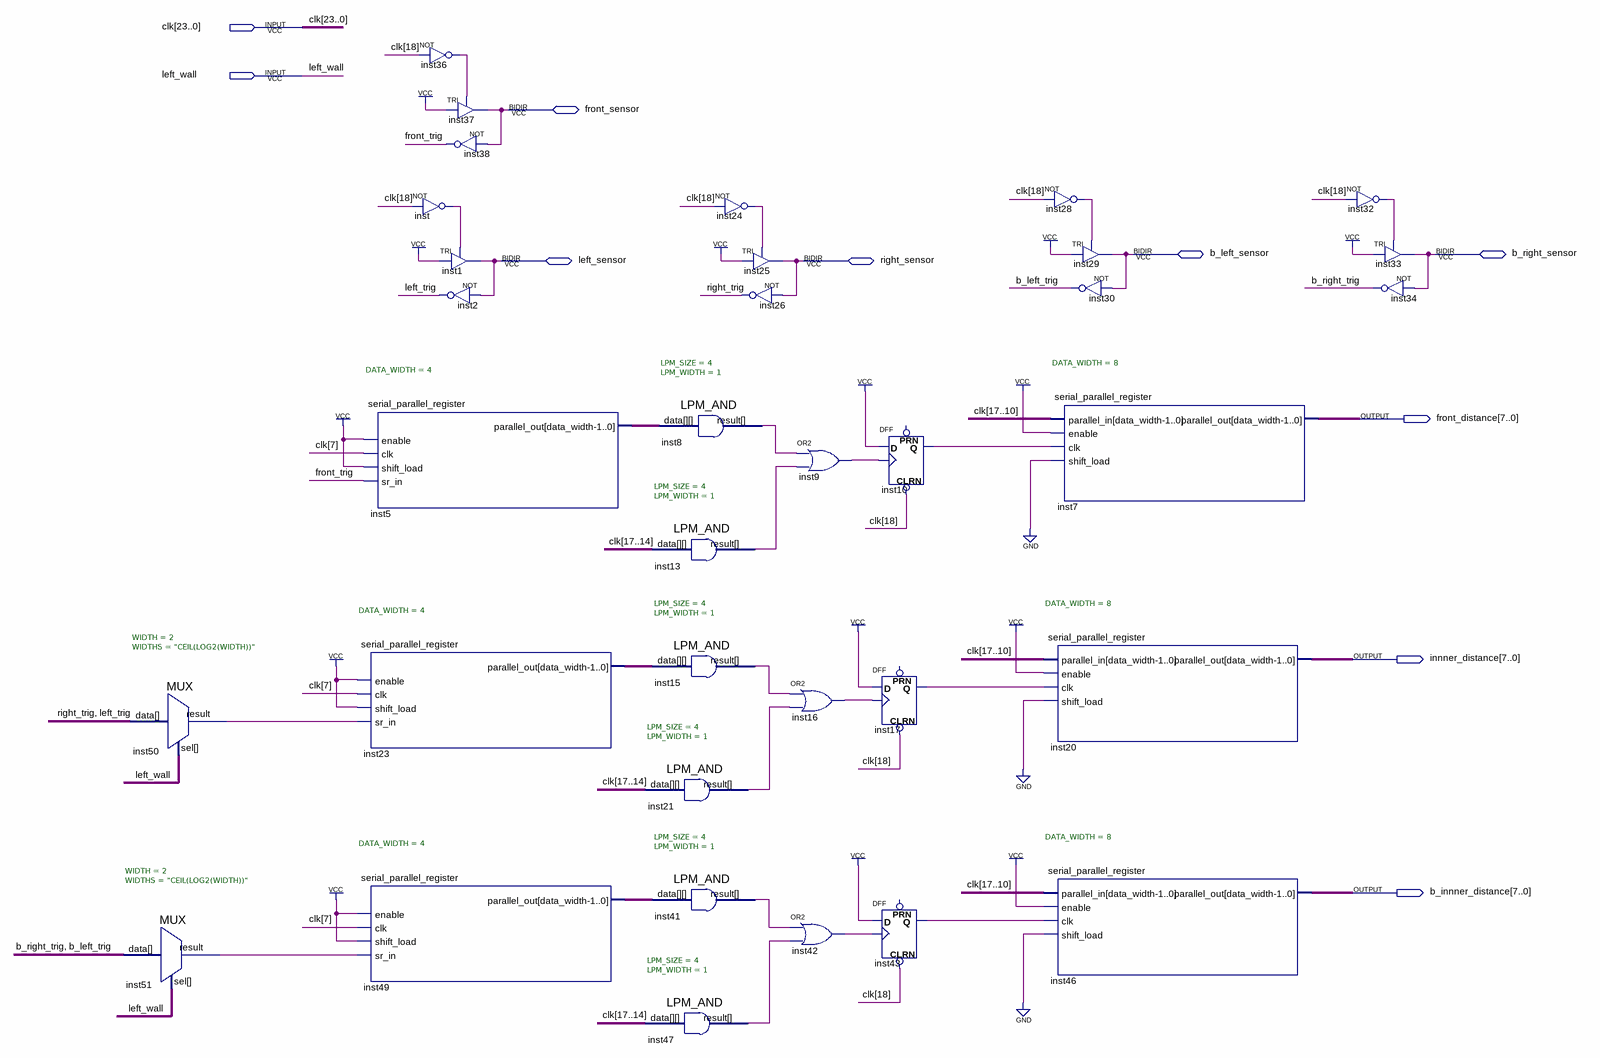
[diagram p0: schematic sheet]
// Quartus schematic IR_sensor_group.bdf as structural Verilog: 35 symbols, 10 pins
module IR_sensor_group (
  input  [23:0] clk,
  input  left_wall,
  inout  front_sensor,
  inout  b_left_sensor,
  inout  b_right_sensor,
  inout  left_sensor,
  inout  right_sensor,
  output [7:0] front_distance,
  output [7:0] innner_distance,
  output [7:0] b_innner_distance
);

  wire b_left_trig, b_right_trig, front_trig, inst8_result, inst9_out, inst10_q, inst13_result,
       inst15_result, inst16_out, inst17_q, inst21_result, inst24_out, inst28_out, inst32_out, inst36_out,
       inst41_result, inst42_out, inst43_q, inst47_result, inst50_result, inst51_result, inst_out, left_trig,
       right_trig;
  wire [3:0] inst5_parallel_out, inst23_parallel_out, inst49_parallel_out;

  MUX #(.WIDTH(2), .WIDTHS("CEIL(LOG2(WIDTH))")) inst50 (
    .data({right_trig, left_trig}), .sel(left_wall), .result(inst50_result));
  MUX #(.WIDTH(2), .WIDTHS("CEIL(LOG2(WIDTH))")) inst51 (
    .data({b_right_trig, b_left_trig}), .sel(left_wall), .result(inst51_result));
  serial_parallel_register #(.DATA_WIDTH(4)) inst5 (
    .clk(clk[7]), .enable(1'b1), .shift_load(1'b1), .sr_in(front_trig), .parallel_out(inst5_parallel_out));
  serial_parallel_register #(.DATA_WIDTH(4)) inst23 (
    .clk(clk[7]), .enable(1'b1), .shift_load(1'b1), .sr_in(inst50_result), .parallel_out(inst23_parallel_out));
  serial_parallel_register #(.DATA_WIDTH(4)) inst49 (
    .clk(clk[7]), .enable(1'b1), .shift_load(1'b1), .sr_in(inst51_result), .parallel_out(inst49_parallel_out));
  not inst36 (inst36_out, clk[18]);
  TRI inst37 (.IN(1'b1), .OE(inst36_out), .OUT(front_sensor));
  not inst38 (front_trig, front_sensor);
  not inst (inst_out, clk[18]);
  TRI inst1 (.IN(1'b1), .OE(inst_out), .OUT(left_sensor));
  not inst2 (left_trig, left_sensor);
  LPM_AND #(.LPM_SIZE(4), .LPM_WIDTH(1)) inst8 (.data(inst5_parallel_out), .result(inst8_result));
  LPM_AND #(.LPM_SIZE(4), .LPM_WIDTH(1)) inst13 (.data(clk[17:14]), .result(inst13_result));
  LPM_AND #(.LPM_SIZE(4), .LPM_WIDTH(1)) inst15 (.data(inst23_parallel_out), .result(inst15_result));
  LPM_AND #(.LPM_SIZE(4), .LPM_WIDTH(1)) inst21 (.data(clk[17:14]), .result(inst21_result));
  LPM_AND #(.LPM_SIZE(4), .LPM_WIDTH(1)) inst41 (.data(inst49_parallel_out), .result(inst41_result));
  LPM_AND #(.LPM_SIZE(4), .LPM_WIDTH(1)) inst47 (.data(clk[17:14]), .result(inst47_result));
  not inst24 (inst24_out, clk[18]);
  TRI inst25 (.IN(1'b1), .OE(inst24_out), .OUT(right_sensor));
  not inst26 (right_trig, right_sensor);
  or inst9 (inst9_out, inst8_result, inst13_result);
  or inst16 (inst16_out, inst15_result, inst21_result);
  or inst42 (inst42_out, inst41_result, inst47_result);
  DFF inst10 (.CLRN(clk[18]), .CLK(inst9_out), .D(1'b1), .Q(inst10_q));  // open: PRN
  DFF inst17 (.CLRN(clk[18]), .CLK(inst16_out), .D(1'b1), .Q(inst17_q));  // open: PRN
  DFF inst43 (.CLRN(clk[18]), .CLK(inst42_out), .D(1'b1), .Q(inst43_q));  // open: PRN
  not inst28 (inst28_out, clk[18]);
  serial_parallel_register #(.DATA_WIDTH(8)) inst7 (
    .clk(inst10_q), .enable(1'b1), .parallel_in(clk[17:10]), .shift_load(1'b0), .parallel_out(front_distance));
  serial_parallel_register #(.DATA_WIDTH(8)) inst20 (
    .clk(inst17_q), .enable(1'b1), .parallel_in(clk[17:10]), .shift_load(1'b0), .parallel_out(innner_distance));
  serial_parallel_register #(.DATA_WIDTH(8)) inst46 (
    .clk(inst43_q), .enable(1'b1), .parallel_in(clk[17:10]), .shift_load(1'b0),
    .parallel_out(b_innner_distance));
  TRI inst29 (.IN(1'b1), .OE(inst28_out), .OUT(b_left_sensor));
  not inst30 (b_left_trig, b_left_sensor);
  not inst32 (inst32_out, clk[18]);
  TRI inst33 (.IN(1'b1), .OE(inst32_out), .OUT(b_right_sensor));
  not inst34 (b_right_trig, b_right_sensor);
endmodule
